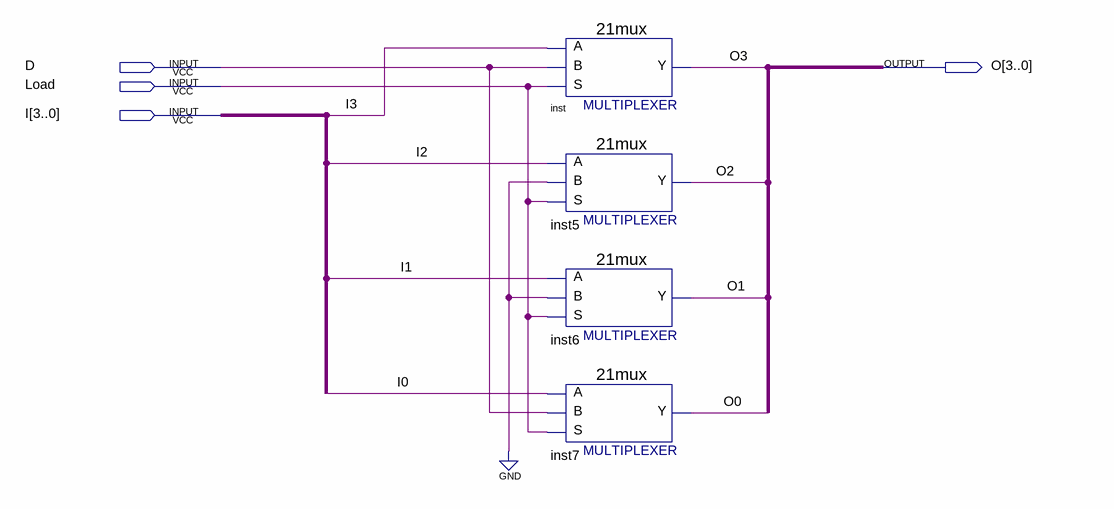
[diagram p0: schematic sheet]
// Quartus schematic IP.bdf as structural Verilog: 4 symbols, 4 pins
module IP (
  input  D,
  input  Load,
  input  [3:0] I,
  output [3:0] O
);

  \21mux  inst (.S(Load), .B(D), .A(I[3]), .Y(O[3]));
  \21mux  inst5 (.S(Load), .B(1'b0), .A(I[2]), .Y(O[2]));
  \21mux  inst6 (.S(Load), .B(1'b0), .A(I[1]), .Y(O[1]));
  \21mux  inst7 (.S(Load), .B(D), .A(I[0]), .Y(O[0]));
endmodule
